# Altium schematic sheet [02] - BLOCK DIAGRAM.SchDoc
size A2; DocumentNumber: 2; SheetNumber: 2; SheetTotal: 4
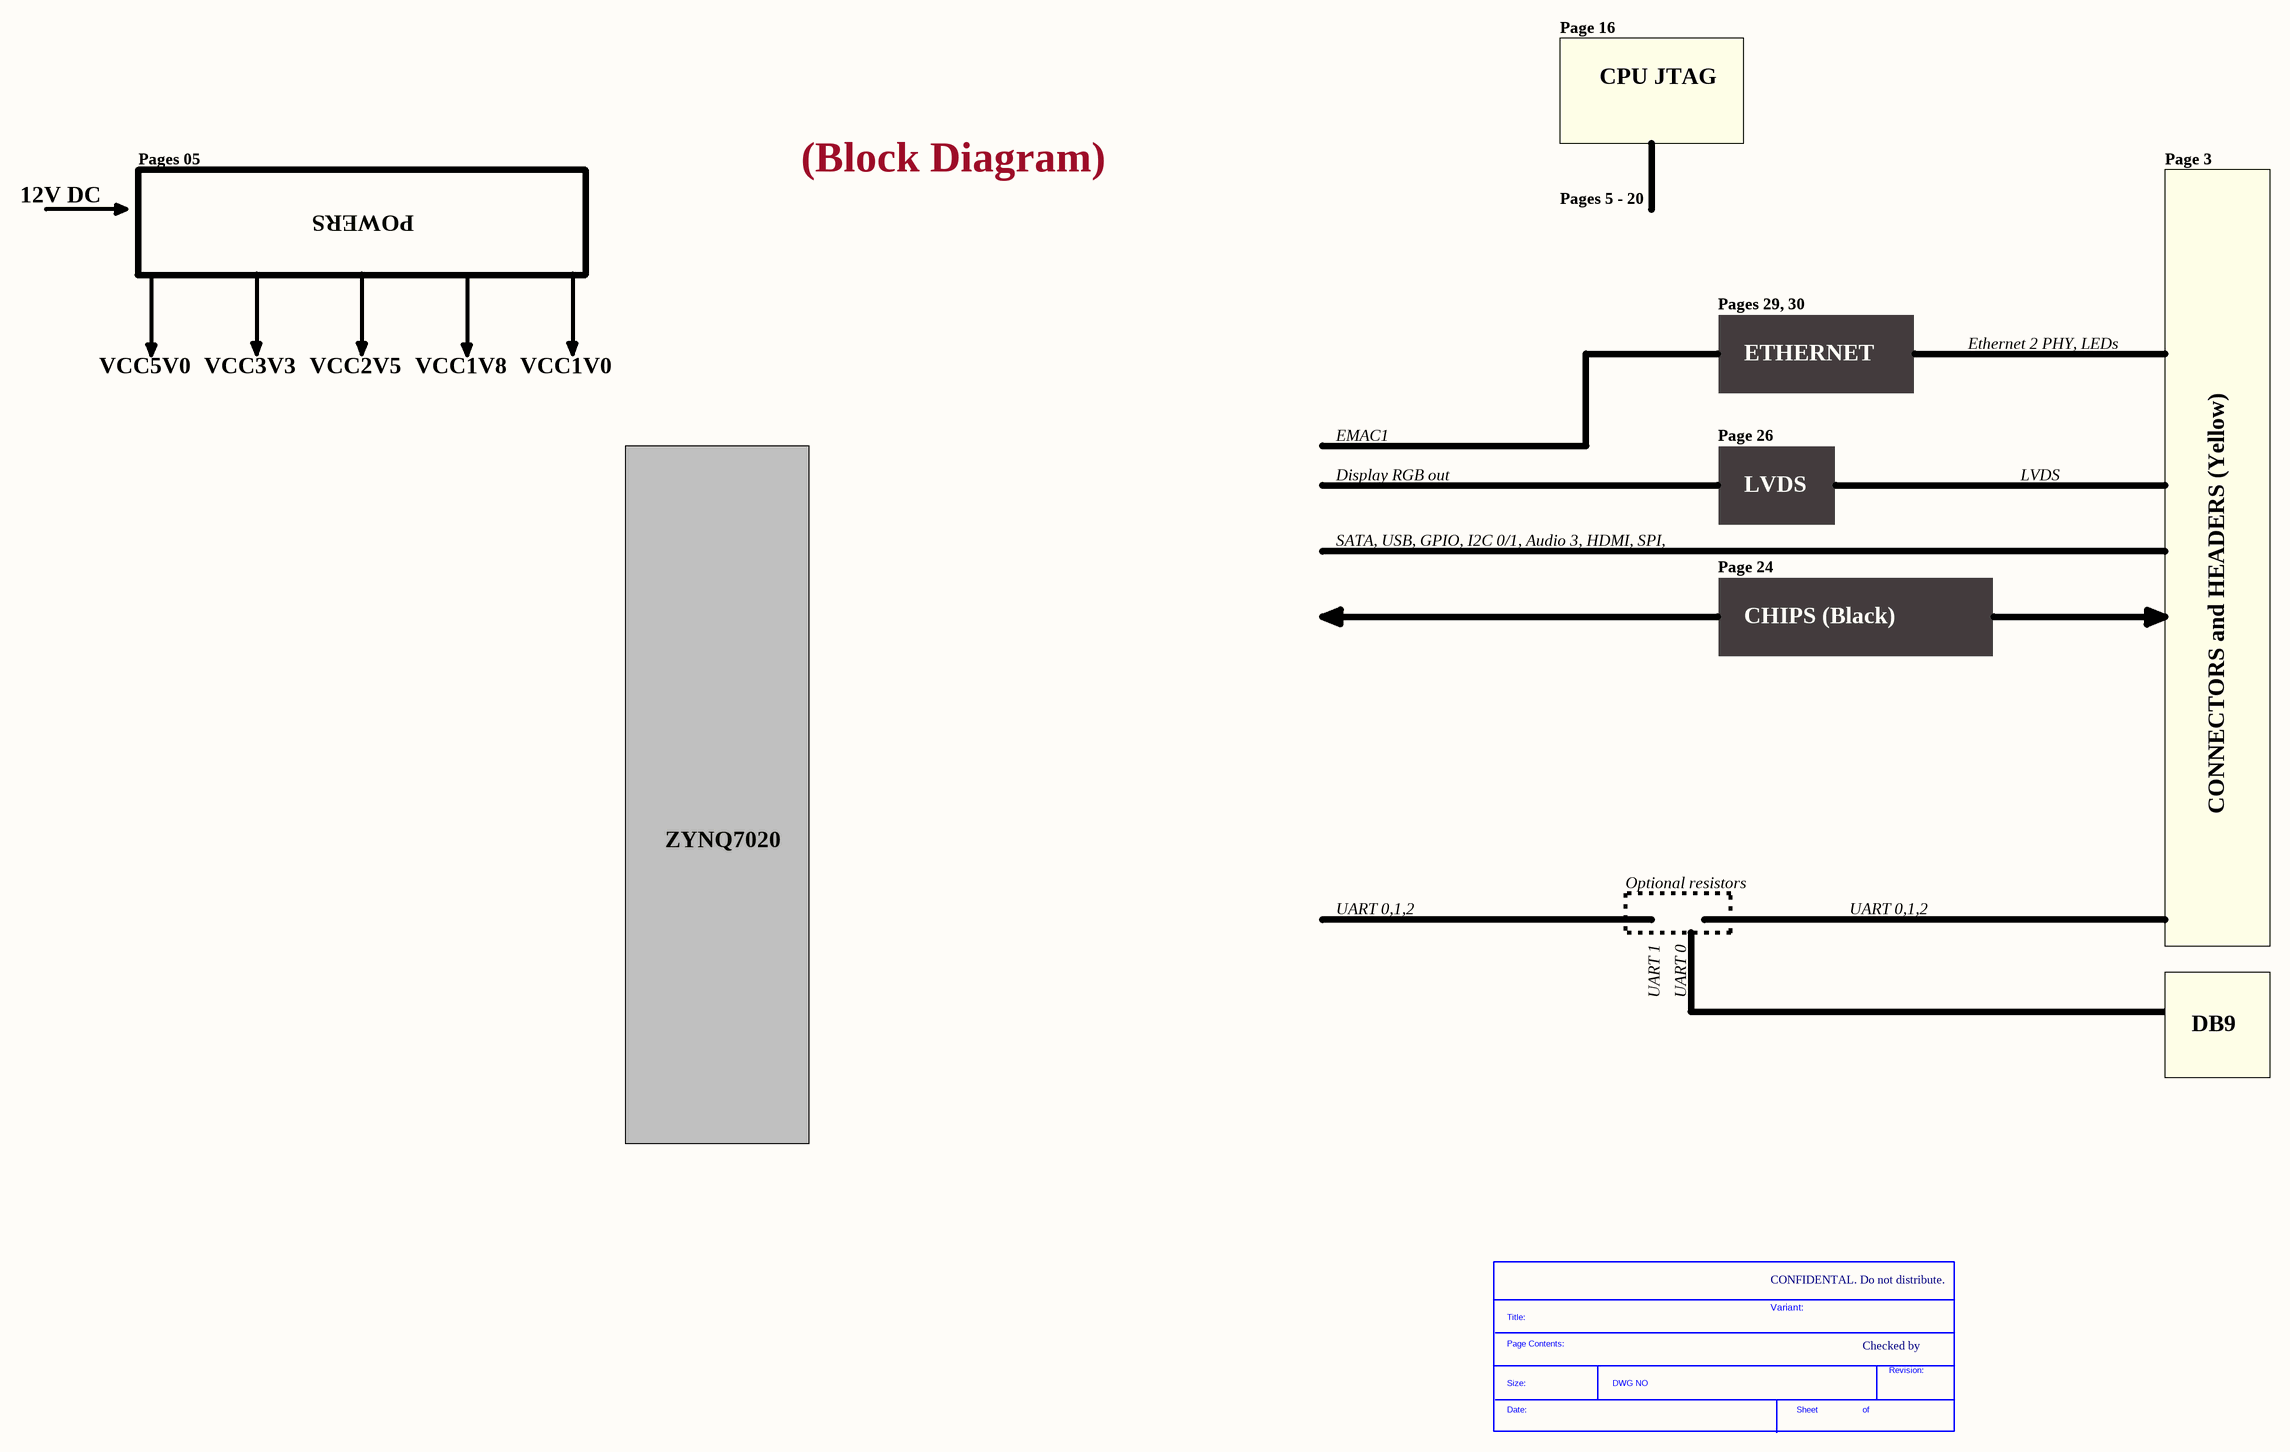
[diagram p0: [02] - BLOCK DIAGRAM.SchDoc]

## Parts
*  SDTitleBlock  (value not drawn)  (graphical)

## Notes on the sheet
- Page 16
- CPU JTAG
- Pages 05
- Page 3
- 12V DC
- POWERS
- (Block Diagram)
- Pages 5 - 20
- Pages 29, 30
- ETHERNET
- Ethernet 2 PHY, LEDs
- VCC5V0
- VCC3V3
- VCC2V5
- VCC1V8
- VCC1V0
- Display RGB out
- EMAC1
- Page 26
- LVDS
- SATA, USB, GPIO, I2C 0/1, Audio 3, HDMI, SPI,
- Page 24
- CHIPS (Black)
- CONNECTORS and HEADERS (Yellow)
- ZYNQ7020
- Optional resistors
- UART 0,1,2
- FPGA
- UART 1
- UART 0
- DB9
- CONFIDENTAL. Do not distribute.
- CLOCKS (CPU & PCIE)
- Variant:
- Checked by
- (in symbol SDTitleBlock) Title:; Page Contents:; Revision:; Size:; DWG NO; Date:; Sheet; of